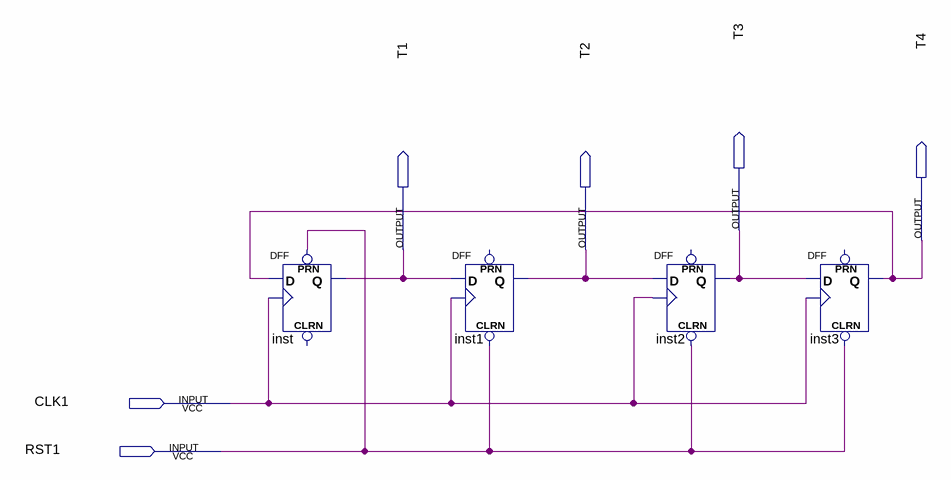
[diagram p0: schematic sheet]
// Quartus schematic step.bdf as structural Verilog: 4 symbols, 6 pins
module step (
  input  CLK1,
  input  RST1,
  output T3,
  output T4,
  output T1,
  output T2
);

  DFF inst (.CLK(CLK1), .D(T4), .PRN(RST1), .Q(T1));  // open: CLRN
  DFF inst1 (.CLRN(RST1), .CLK(CLK1), .D(T1), .Q(T2));  // open: PRN
  DFF inst2 (.CLRN(RST1), .CLK(CLK1), .D(T2), .Q(T3));  // open: PRN
  DFF inst3 (.CLRN(RST1), .CLK(CLK1), .D(T3), .Q(T4));  // open: PRN
endmodule
